# EAGLE design uNimbus_board_1_v1_2 (EAGLE 9.3.1)

## Sheet 1 of 2
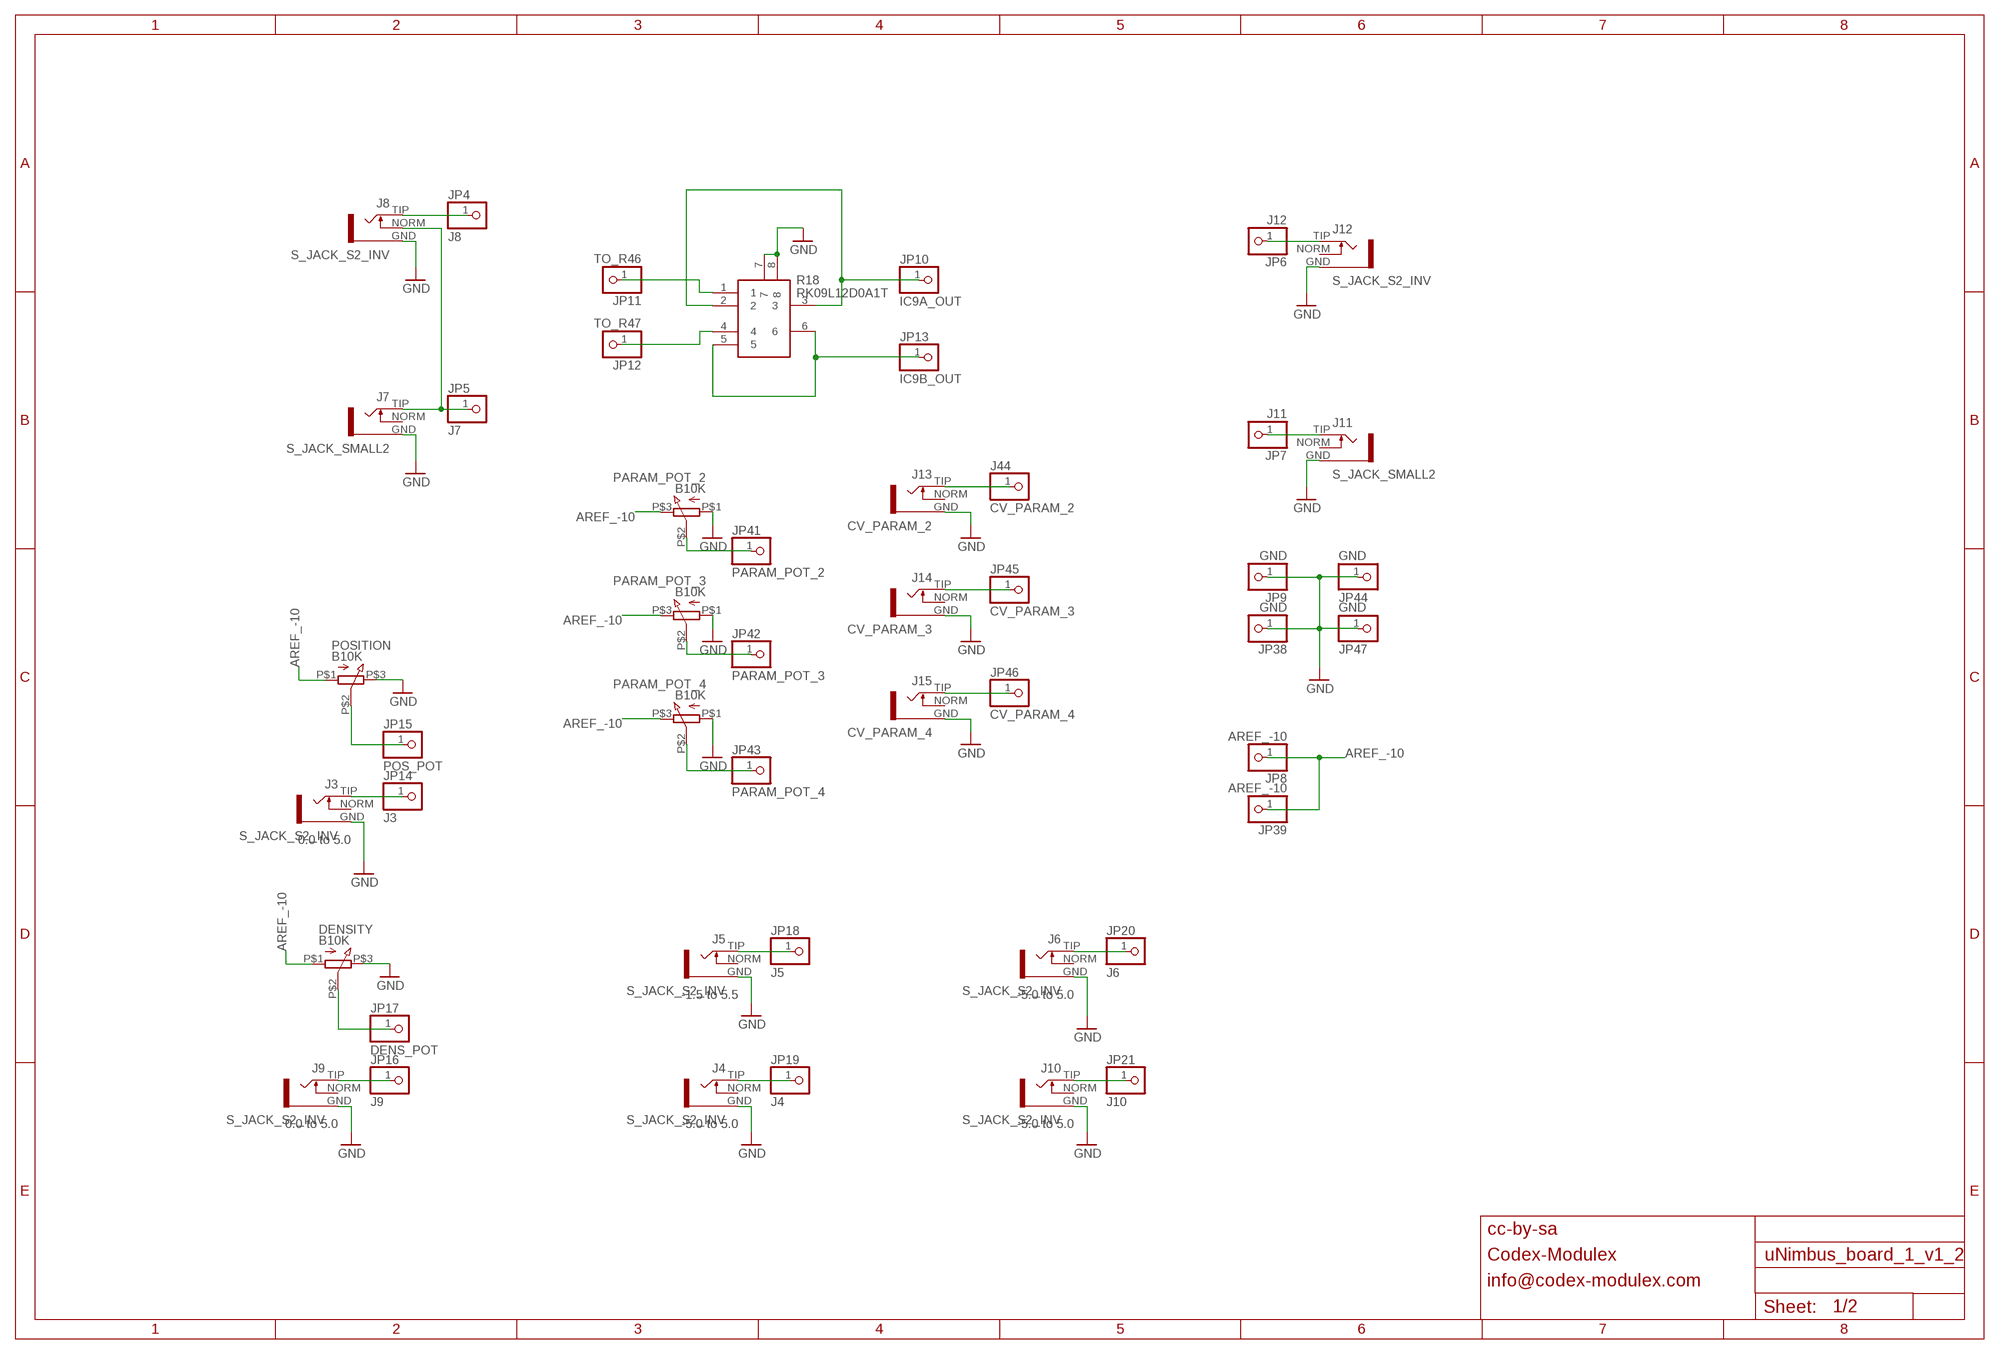
[diagram p0: schematic, sheet 1]

### Parts
DENSITY  B10K  Q-POT2  [Q-POT2]
J3  S_JACK_S2_INV  [S_JACK_S2_INV]
J4  S_JACK_S2_INV  [S_JACK_S2_INV]
J5  S_JACK_S2_INV  [S_JACK_S2_INV]
J6  S_JACK_S2_INV  [S_JACK_S2_INV]
J7  S_JACK_SMALL2  [S_JACK_SMALL2]
J8  S_JACK_S2_INV  [S_JACK_S2_INV]
J9  S_JACK_S2_INV  [S_JACK_S2_INV]
J10  S_JACK_S2_INV  [S_JACK_S2_INV]
J11  S_JACK_SMALL2  [S_JACK_SMALL2]
J12  S_JACK_S2_INV  [S_JACK_S2_INV]
J13  CV_PARAM_2  S_JACK_S2_INV  [S_JACK_S2_INV]
J14  CV_PARAM_3  S_JACK_S2_INV  [S_JACK_S2_INV]
J15  CV_PARAM_4  S_JACK_S2_INV  [S_JACK_S2_INV]
J44  CV_PARAM_2  PARTS_AMAN_PINHD-1X1  [PARTS_AMAN_1X01]
JP4  J8  PARTS_AMAN_PINHD-1X1  [PARTS_AMAN_1X01]
JP5  J7  PARTS_AMAN_PINHD-1X1  [PARTS_AMAN_1X01]
JP6  J12  PARTS_AMAN_PINHD-1X1  [PARTS_AMAN_1X01]
JP7  J11  PARTS_AMAN_PINHD-1X1  [PARTS_AMAN_1X01]
JP8  AREF_-10  PARTS_AMAN_PINHD-1X1  [PARTS_AMAN_1X01]
JP9  GND  PARTS_AMAN_PINHD-1X1  [PARTS_AMAN_1X01]
JP10  IC9A_OUT  PARTS_AMAN_PINHD-1X1  [PARTS_AMAN_1X01]
JP11  TO_R46  PARTS_AMAN_PINHD-1X1  [PARTS_AMAN_1X01]
JP12  TO_R47  PARTS_AMAN_PINHD-1X1  [PARTS_AMAN_1X01]
JP13  IC9B_OUT  PARTS_AMAN_PINHD-1X1  [PARTS_AMAN_1X01]
JP14  J3  PARTS_AMAN_PINHD-1X1  [PARTS_AMAN_1X01]
JP15  POS_POT  PARTS_AMAN_PINHD-1X1  [PARTS_AMAN_1X01]
JP16  J9  PARTS_AMAN_PINHD-1X1  [PARTS_AMAN_1X01]
JP17  DENS_POT  PARTS_AMAN_PINHD-1X1  [PARTS_AMAN_1X01]
JP18  J5  PARTS_AMAN_PINHD-1X1  [PARTS_AMAN_1X01]
JP19  J4  PARTS_AMAN_PINHD-1X1  [PARTS_AMAN_1X01]
JP20  J6  PARTS_AMAN_PINHD-1X1  [PARTS_AMAN_1X01]
JP21  J10  PARTS_AMAN_PINHD-1X1  [PARTS_AMAN_1X01]
JP38  GND  PARTS_AMAN_PINHD-1X1  [PARTS_AMAN_1X01]
JP39  AREF_-10  PARTS_AMAN_PINHD-1X1  [PARTS_AMAN_1X01]
JP41  PARAM_POT_2  PARTS_AMAN_PINHD-1X1  [PARTS_AMAN_1X01]
JP42  PARAM_POT_3  PARTS_AMAN_PINHD-1X1  [PARTS_AMAN_1X01]
JP43  PARAM_POT_4  PARTS_AMAN_PINHD-1X1  [PARTS_AMAN_1X01]
JP44  GND  PARTS_AMAN_PINHD-1X1  [PARTS_AMAN_1X01]
JP45  CV_PARAM_3  PARTS_AMAN_PINHD-1X1  [PARTS_AMAN_1X01]
JP46  CV_PARAM_4  PARTS_AMAN_PINHD-1X1  [PARTS_AMAN_1X01]
JP47  GND  PARTS_AMAN_PINHD-1X1  [PARTS_AMAN_1X01]
PARAM_POT_2  B10K  Q-POT2  [Q-POT2]
PARAM_POT_3  B10K  Q-POT2  [Q-POT2]
PARAM_POT_4  B10K  Q-POT2  [Q-POT2]
POSITION  B10K  Q-POT2  [Q-POT2]
R18  RK09L12D0A1T  [RK09L12D0A1T]

### Nets
AREF_-10: DENSITY.P$1 JP8.1 JP39.1 PARAM_POT_2.P$3 PARAM_POT_3.P$3 PARAM_POT_4.P$3 POSITION.P$1
GND: DENSITY.P$3 J3.GND J4.GND J5.GND J6.GND J7.GND J8.GND J9.GND J10.GND J11.GND J12.GND J13.GND J14.GND J15.GND JP9.1 JP38.1 JP44.1 JP47.1 PARAM_POT_2.P$1 PARAM_POT_3.P$1 PARAM_POT_4.P$1 POSITION.P$3 R18.7 R18.8 ; also sheet 2
LOUT_JACK: J11.TIP JP7.1
N$1: J4.TIP JP19.1
N$4: J10.TIP JP21.1
N$6: J6.TIP JP20.1
N$10: J5.TIP JP18.1
N$14: J9.TIP JP16.1
N$18: JP12.1 R18.4
N$20: J8.TIP JP4.1
N$21: J7.TIP J8.NORM JP5.1
N$22: JP13.1 R18.5 R18.6
N$25: JP42.1 PARAM_POT_3.P$2
N$26: DENSITY.P$2 JP17.1
N$27: J3.TIP JP14.1
N$28: JP43.1 PARAM_POT_4.P$2
N$30: JP41.1 PARAM_POT_2.P$2
N$31: JP11.1 R18.1
N$32: J15.TIP JP46.1
N$33: J14.TIP JP45.1
N$35: JP15.1 POSITION.P$2
N$37: J13.TIP J44.1
N$42: JP10.1 R18.2 R18.3
ROUT_JACK: J12.TIP JP6.1
Unconnected: J3.NORM J4.NORM J5.NORM J6.NORM J7.NORM J9.NORM J10.NORM J11.NORM J12.NORM J13.NORM J14.NORM J15.NORM

### Notes on the sheet
- 0.0 to 5.0
- -1.5 to 5.5 | -5.0 to 5.0
- 0.0 to 5.0 | -5.0 to 5.0 | -5.0 to 5.0
- cc-by-sa
- Codex-Modulex
- info@codex-modulex.com

## Sheet 2 of 2
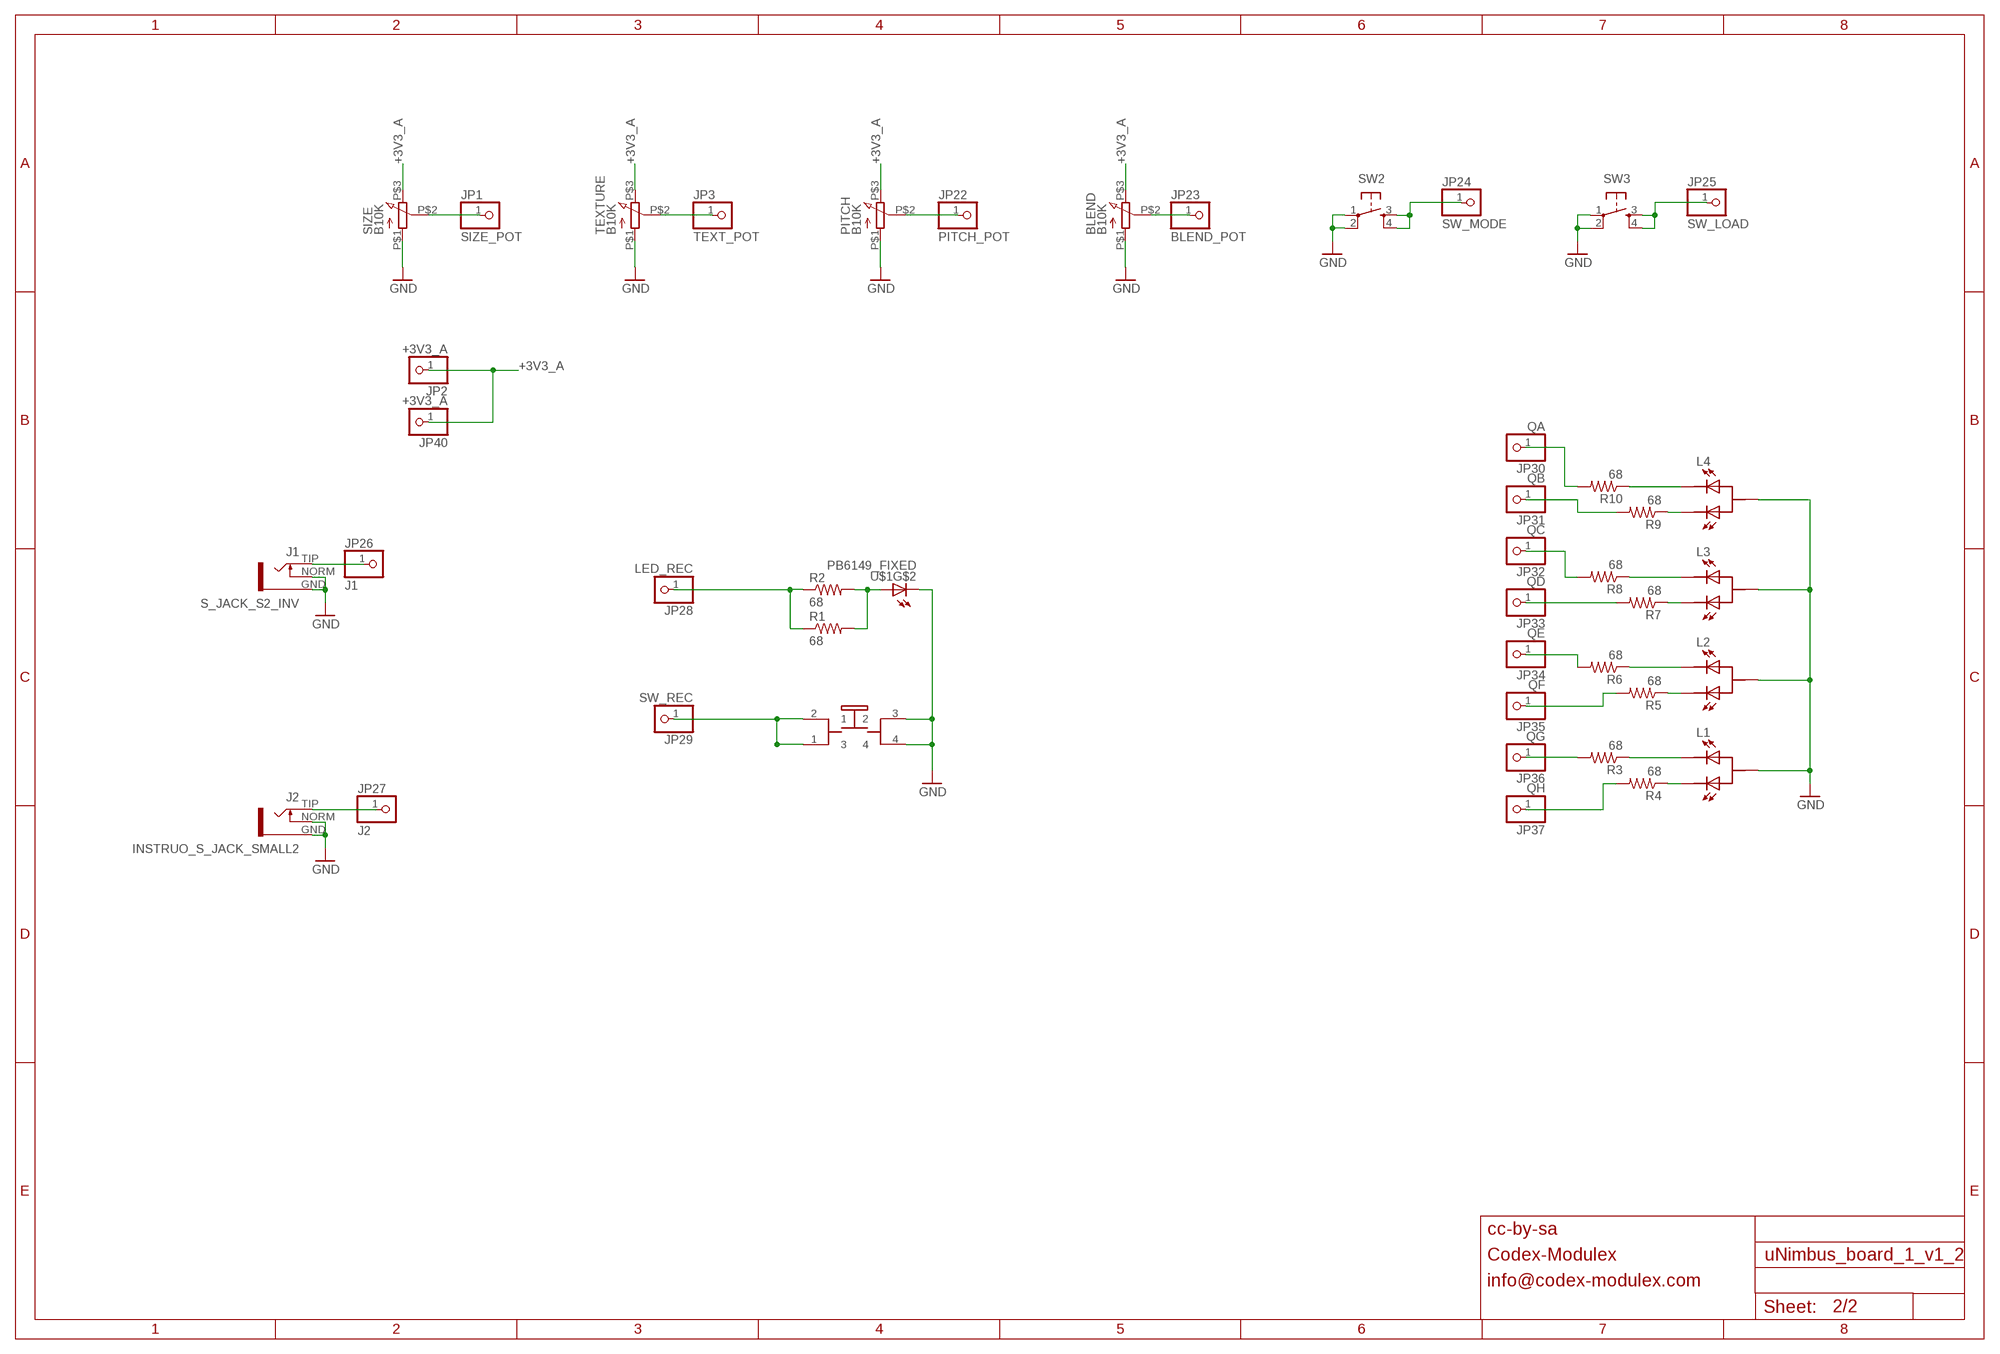
[diagram p1: schematic, sheet 2]

### Parts
BLEND  B10K  Q-POT2  [Q-POT2]
J1  S_JACK_S2_INV  [S_JACK_S2_INV]
J2  INSTRUO_S_JACK_SMALL2  [INSTRUO_S_JACK_SMALL2]
JP1  SIZE_POT  PARTS_AMAN_PINHD-1X1  [PARTS_AMAN_1X01]
JP2  +3V3_A  PARTS_AMAN_PINHD-1X1  [PARTS_AMAN_1X01]
JP3  TEXT_POT  PARTS_AMAN_PINHD-1X1  [PARTS_AMAN_1X01]
JP22  PITCH_POT  PARTS_AMAN_PINHD-1X1  [PARTS_AMAN_1X01]
JP23  BLEND_POT  PARTS_AMAN_PINHD-1X1  [PARTS_AMAN_1X01]
JP24  SW_MODE  PARTS_AMAN_PINHD-1X1  [PARTS_AMAN_1X01]
JP25  SW_LOAD  PARTS_AMAN_PINHD-1X1  [PARTS_AMAN_1X01]
JP26  J1  PARTS_AMAN_PINHD-1X1  [PARTS_AMAN_1X01]
JP27  J2  PARTS_AMAN_PINHD-1X1  [PARTS_AMAN_1X01]
JP28  LED_REC  PARTS_AMAN_PINHD-1X1  [PARTS_AMAN_1X01]
JP29  SW_REC  PARTS_AMAN_PINHD-1X1  [PARTS_AMAN_1X01]
JP30  QA  PARTS_AMAN_PINHD-1X1  [PARTS_AMAN_1X01]
JP31  QB  PARTS_AMAN_PINHD-1X1  [PARTS_AMAN_1X01]
JP32  QC  PARTS_AMAN_PINHD-1X1  [PARTS_AMAN_1X01]
JP33  QD  PARTS_AMAN_PINHD-1X1  [PARTS_AMAN_1X01]
JP34  QE  PARTS_AMAN_PINHD-1X1  [PARTS_AMAN_1X01]
JP35  QF  PARTS_AMAN_PINHD-1X1  [PARTS_AMAN_1X01]
JP36  QG  PARTS_AMAN_PINHD-1X1  [PARTS_AMAN_1X01]
JP37  QH  PARTS_AMAN_PINHD-1X1  [PARTS_AMAN_1X01]
JP40  +3V3_A  PARTS_AMAN_PINHD-1X1  [PARTS_AMAN_1X01]
L1  LED_3MM_3PIN  [LED_3MM_3PIN]
L2  LED_3MM_3PIN  [LED_3MM_3PIN]
L3  LED_3MM_3PIN  [LED_3MM_3PIN]
L4  LED_3MM_3PIN  [LED_3MM_3PIN]
PITCH  B10K  Q-POT2  [Q-POT2]
R1  68  R-US_R0603  [R0603]
R2  68  R-US_R0603  [R0603]
R3  68  R-US_R0603  [R0603]
R4  68  R-US_R0603  [R0603]
R5  68  R-US_R0603  [R0603]
R6  68  R-US_R0603  [R0603]
R7  68  R-US_R0603  [R0603]
R8  68  R-US_R0603  [R0603]
R9  68  R-US_R0603  [R0603]
R10  68  R-US_R0603  [R0603]
SIZE  B10K  Q-POT2  [Q-POT2]
SW2  TAC_SWITCHPTH  [TACTILE-PTH]
SW3  TAC_SWITCHPTH  [TACTILE-PTH]
TEXTURE  B10K  Q-POT2  [Q-POT2]
U$1  PB6149_FIXED  [PB6149L]

### Nets
+3V3_A: BLEND.P$3 JP2.1 JP40.1 PITCH.P$3 SIZE.P$3 TEXTURE.P$3
GND: BLEND.P$1 J1.GND J1.NORM J2.GND J2.NORM L1.A L2.A L3.A L4.A PITCH.P$1 SIZE.P$1 SW2.1 SW2.2 SW3.1 SW3.2 TEXTURE.P$1 U$1.3 U$1.4 U$1.K(C) ; also sheet 1
LED_REC: JP28.1 R1.1 R2.1
N$2: JP1.1 SIZE.P$2
N$3: JP3.1 TEXTURE.P$2
N$5: JP22.1 PITCH.P$2
N$7: BLEND.P$2 JP23.1
N$8: JP30.1 R10.2
N$9: L4.C1 R9.1
N$11: JP31.1 R9.2
N$12: L4.C2 R10.1
N$13: JP33.1 R7.2
N$15: JP34.1 R6.2
N$16: L3.C2 R8.1
N$17: JP35.1 R5.2
N$19: JP36.1 R3.2
N$23: JP37.1 R4.2
N$24: JP32.1 R8.2
N$29: L3.C1 R7.1
N$34: L2.C2 R6.1
N$36: J2.TIP JP27.1
N$38: R1.2 R2.2 U$1.A
N$39: L2.C1 R5.1
N$40: L1.C2 R3.1
N$41: L1.C1 R4.1
N$57: J1.TIP JP26.1
SW_LOAD: JP25.1 SW3.3 SW3.4
SW_MODE: JP24.1 SW2.3 SW2.4
SW_REC: JP29.1 U$1.1 U$1.2

### Notes on the sheet
- cc-by-sa
- Codex-Modulex
- info@codex-modulex.com

## Library data of the parts
BLEND DENSITY PITCH POSITION SIZE TEXTURE = INSTRUO:Q-POT2
J1 J4-J6 J8-J10 J12-J15 = INSTRUO:S_JACK_S2_INV
J2 = uClouds_002_:INSTRUO_S_JACK_SMALL2
J3 = uClouds_002:S_JACK_S2_INV
J7 = INSTRUO:S_JACK_SMALL2
J11 = uClouds_002:S_JACK_SMALL2
J44 JP1-JP47 = atom_v1_1_board_2:PARTS_AMAN_PINHD-1X1: PIN HEADER
L1-L4 = INSTRUO:LED_3MM_3PIN
PARAM_POT_2-PARAM_POT_4 = uClouds_002:Q-POT2
R1-R10 = rcl:R-US_: RESISTOR, American symbol
R18 = RK09L12D0A1T:RK09L12D0A1T: Alps Potentiometer RK09L Series with a 6 mm Dia. Shaft 10k 20% 0.05W, Logarithmic, Panel Mount (Through Hole) Source: Datasheet <https://componentsearchengine.com/Datasheets/1/RK09L12D0A1T.pdf>; DESCRIPTION: Alps Potentiometer RK09L Series with a 6 mm Dia. Shaft 10k 20% 0.05W, Logarithmic, Panel Mount (Through Hole); HEIGHT: mm; MANUFACTURER_NAME: ALPS; MANUFACTURER_PART_NUMBER: RK09L12D0A1T; MOUSER_PART_NUMBER: 688-RK09L12D0A1T
SW2 SW3 = SparkFun:TAC_SWITCH: Momentary Switch Button commonly used for reset or general input. Spark Fun Electronics SKU : COM-00097
U$1 = INSTRUO:PB6149_FIXED

## Board
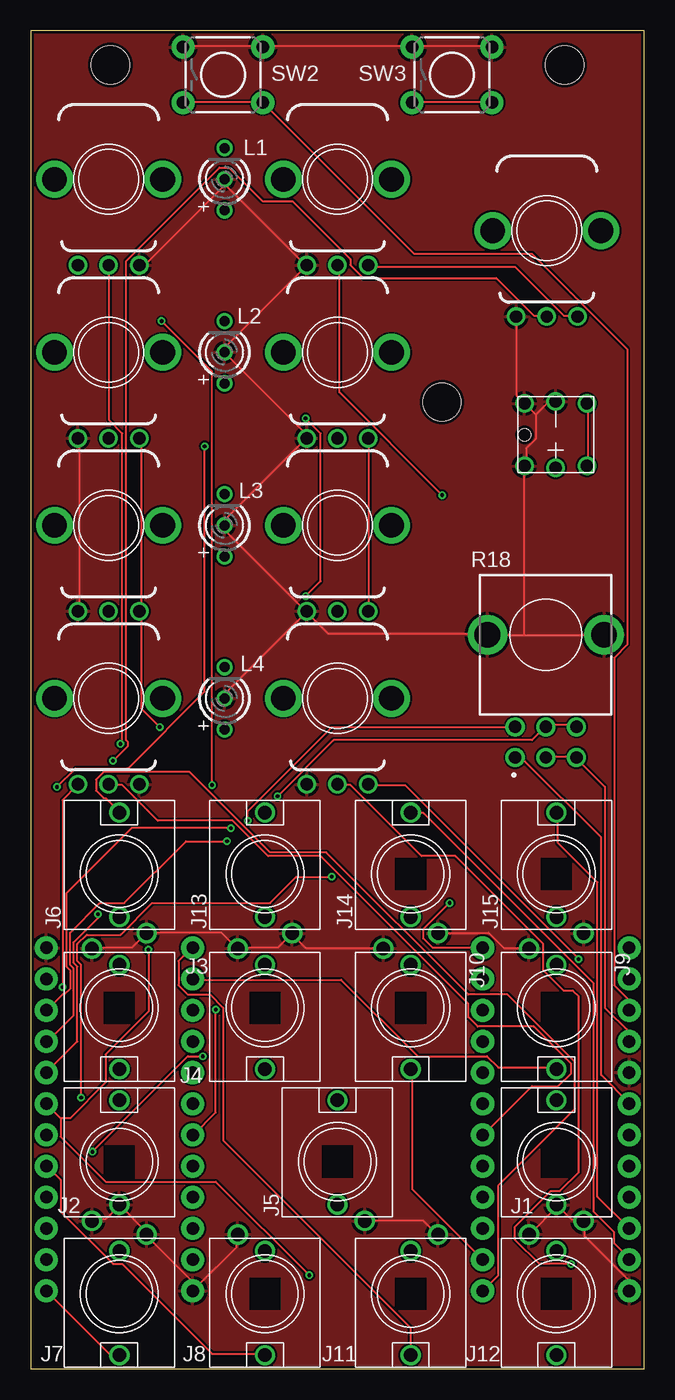
[diagram p2: board, top side]
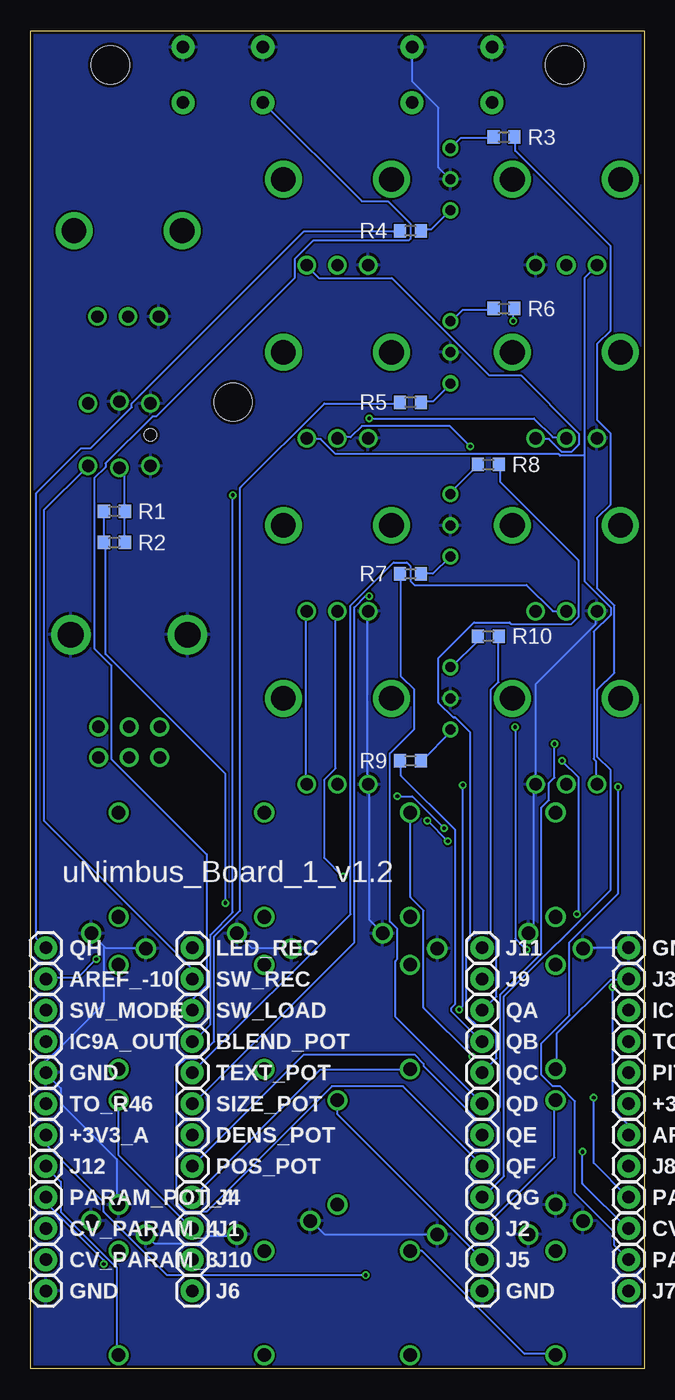
[diagram p3: board, bottom side, seen from below]

Size 50 x 109 mm. Coordinates in mm from the lower left corner, seen from the top.
Outline: 0,0 50,0 50,109 0,109 0,0
Copper layers (1*16): Top 0.035mm / dielectric 1.5mm / Bottom 0.035mm
Design rules "dirt_cheap_dirty_boards.v1.1": minimum track width 6mil, minimum drill 12mil, track to track 6mil, track to pad 6mil, pad to pad 6mil, via to via 6mil, smd to smd 0mil, copper to edge 10mil, drill to drill 10mil, minimum pad ring 10mil, minimum via ring 6mil, stop-mask expansion 2mil, vias tented up to drill 25mil, thermal gap 10mil
Holes 3.1 mm at 6.5,106.2 43.5,106.2 33.51,78.74

### Footprints (pad centres in the part's own frame; a part is rotated, then mirrored left to right if it is on the bottom)
Q-POT2 = drill 1 pad 1.5: P$1 -2.5,-7; P$2 0,-7; P$3 2.5,-7 | drill 2 pad 2.5: P$4 -4.4,0; P$5 4.4,0
S_JACK_S2_INV = drill 1.1: GND 2.223,-4.826; NORM 0,-3.5; TIP 0,5
INSTRUO_S_JACK_SMALL2 = drill 1.1: GND -2.223,-4.826; NORM 0,-3.5; TIP 0,5
S_JACK_SMALL2 = drill 1.1: GND -2.223,-4.826; NORM 0,-3.5; TIP 0,5
PARTS_AMAN_1X01 = drill 1.016 pad 1.88: 1 0,0
LED_3MM_3PIN = drill 0.813: A 0,0; C1 -2.54,0; C2 2.54,0
R0603 = smd 1 x 1.1: 1 -0.85,0; 2 0.85,0
RK09L12D0A1T = drill 1 pad 1.55: 1 -2.5,-14.85; 2 0,-14.85; 3 2.5,-14.85; 4 -2.5,-12.35; 5 0,-12.35; 6 2.5,-12.35 | drill 2.11 pad 3.2: 7 -4.75,-4.85; 8 4.75,-4.85
TACTILE-PTH = drill 1.016 pad 1.88: 1 -3.251,2.261; 2 3.251,2.261; 3 -3.251,-2.261; 4 3.251,-2.261
PB6149L = drill 1: 1 2.54,-2.54; 2 2.54,2.54; 3 -2.54,-2.54; 4 -2.54,2.54; A 0,-2.7; K 0,2.7 | hole 1: -2.54,0

### Placement (x,y rotation side)
BLEND  25,96.9 0 top
DENSITY  6.35,54.61 0 top
J1  42.84,16.87 0 top
J2  7.22,16.87 0 top
J3  7.22,29.41 180 top
J4  19.09,29.41 180 top
J5  25,16.87 0 top
J6  7.22,40.31 0 top
J7  7.22,6.11 180 top
J8  19.09,6.11 180 top
J9  42.84,29.41 180 top
J10  30.97,29.41 180 top
J11  30.97,6.11 180 top
J12  42.84,6.11 180 top
J13  19.09,40.31 0 top
J14  30.97,40.31 0 top
J15  42.84,40.31 0 top
J44  1.27,11.43 0 bottom
JP1  36.83,21.59 0 bottom
JP2  48.77,19.05 0 bottom
JP3  36.83,24.13 0 bottom
JP4  1.27,16.51 0 bottom
JP5  1.27,6.35 0 bottom
JP6  48.77,16.51 0 bottom
JP7  13.21,34.29 0 bottom
JP8  1.27,19.05 0 bottom
JP9  1.27,34.29 0 bottom
JP10  48.77,26.67 0 bottom
JP11  48.77,21.59 0 bottom
JP12  1.27,26.67 0 bottom
JP13  1.27,29.21 0 bottom
JP14  1.27,31.75 0 bottom
JP15  36.83,16.51 0 bottom
JP16  13.21,31.75 0 bottom
JP17  36.83,19.05 0 bottom
JP18  13.21,8.89 0 bottom
JP19  36.83,13.97 0 bottom
JP20  36.83,6.35 0 bottom
JP21  36.83,8.89 0 bottom
JP22  1.27,24.13 0 bottom
JP23  36.83,26.67 0 bottom
JP24  48.77,29.21 0 bottom
JP25  36.83,29.21 0 bottom
JP26  36.83,11.43 0 bottom
JP27  13.21,11.43 0 bottom
JP28  36.83,34.29 0 bottom
JP29  36.83,31.75 0 bottom
JP30  13.21,29.21 0 bottom
JP31  13.21,26.67 0 bottom
JP32  13.21,24.13 0 bottom
JP33  13.21,21.59 0 bottom
JP34  13.21,19.05 0 bottom
JP35  13.21,16.51 0 bottom
JP36  13.21,13.97 0 bottom
JP37  48.77,34.29 0 bottom
JP38  13.21,6.35 0 bottom
JP39  48.77,31.75 0 bottom
JP40  1.27,21.59 0 bottom
JP41  1.27,8.89 0 bottom
JP42  1.27,13.97 0 bottom
JP43  48.77,13.97 0 bottom
JP44  48.77,24.13 0 bottom
JP45  48.77,8.89 0 bottom
JP46  48.77,11.43 0 bottom
JP47  48.77,6.35 0 bottom
L1  15.8,96.9 90 top
L2  15.8,82.8 90 top
L3  15.8,68.71 90 top
L4  15.8,54.61 90 top
PARAM_POT_2  25,82.8 0 top
PARAM_POT_3  25,68.71 0 top
PARAM_POT_4  25,54.61 0 top
PITCH  42.06,92.71 0 top
POSITION  6.35,96.9 0 top
R1  43.18,69.85 0 bottom
R2  43.18,67.31 0 bottom
R3  11.43,100.33 0 bottom
R4  19.05,92.71 180 bottom
R5  19.05,78.74 180 bottom
R6  11.43,86.36 0 bottom
R7  19.05,64.77 180 bottom
R8  12.7,73.66 0 bottom
R9  19.05,49.53 180 bottom
R10  12.7,59.69 0 bottom
R18  41.98,64.64 0 top
SIZE  6.35,82.8 0 top
SW2  15.67,105.41 0 top
SW3  34.33,105.41 0 top
TEXTURE  6.35,68.71 0 top
U$1  42.78,76.09 0 top

### Tracks (layer width: path | path; a pad name or v marks a point on that pad's centre or on a via)
+3V3_A  (via drill 0.3)
  Top 0.152: v22.71,7.62 15.09,15.24 6.1,15.24 2.44,18.9 2.44,20.42 | JP40.1 2.44,20.42 | SIZE.P$3 8.99,75.74 8.99,61.72 TEXTURE.P$3 8.99,61.57 8.99,53.8 v10.52,52.27 | PITCH.P$3 44.5,85.8 43.43,85.8 39.47,89.76 27.58,89.76 BLEND.P$3 | 2.44,20.42 3.2,20.42 6.1,23.32 6.1,25.6 9.6,29.11 v9.6,34.14
  Bottom 0.152: JP2.1 48.77,18.29 44.04,13.56 44.04,12.8 38.86,7.62 v22.71,7.62 | SIZE.P$3 8.84,75.74 7.77,75.74 6.71,74.68 5.94,74.68 5.33,75.29 5.33,76.2 10.06,80.92 12.65,80.92 20.57,88.85 26.52,88.85 27.43,89.76 BLEND.P$3 | v9.6,34.14 10.52,35.05 v10.52,52.27
AREF_-10  (via drill 0.3)
  Top 0.152: PARAM_POT_2.P$3 27.58,75.74 27.58,61.72 PARAM_POT_3.P$3 | v44.65,33.38 30.48,47.55 27.58,47.55 PARAM_POT_4.P$3 | v2.59,31.09 2.59,46.33 3.81,47.55 DENSITY.P$1
  Bottom 0.152: PARAM_POT_4.P$3 27.58,47.7 27.58,61.57 PARAM_POT_3.P$3 | v44.65,33.38 46.18,31.85 48.77,31.85 JP39.1 | 4.88,74.37 4.88,88.85 3.96,89.76 POSITION.P$1 | 4.88,74.37 4.88,64.16 2.74,62.03 2.74,61.42 4.12,60.05 4.12,49.68 3.96,49.53 3.96,47.7 DENSITY.P$1 | v2.59,31.09 2.59,21.18 1.37,19.96 1.37,19.05 JP8.1 | 4.88,74.37 6.86,74.37 7.01,74.52 25.15,74.52 26.36,75.74 27.43,75.74 PARAM_POT_2.P$3
GND
  Top 0.152: 41.15,77.72 41.15,75.74 40.39,74.98 40.39,73.61 U$1.3 40.23,73.46 40.23,59.74 | 41.15,77.72 40.39,78.49 U$1.4 39.62,79.25 39.62,85.65 PITCH.P$1 | 41.15,77.72 42.22,78.79 42.67,78.79 U$1.K | 40.23,59.74 46.63,59.74 R18.8 | 40.23,59.74 37.34,59.74 R18.7 37.19,59.89 24.23,59.89 22.55,61.57 PARAM_POT_3.P$1 | SW2.1 12.5,107.75 18.9,107.75 SW2.2 19.05,107.75 30.94,107.75 SW3.1 31.09,107.75 37.49,107.75 SW3.2 | L4.A 15.85,54.71 15.85,55.02 22.4,61.57 PARAM_POT_3.P$1 | PARAM_POT_3.P$1 22.4,61.72 15.85,68.28 15.85,68.58 L3.A 15.85,68.73 15.85,69.19 22.4,75.74 PARAM_POT_2.P$1 22.4,75.89 22.4,76.2 15.85,82.75 L2.A 15.85,82.91 15.85,83.21 22.4,89.76 BLEND.P$1 22.4,89.92 15.85,96.47 | 15.85,96.47 15.85,96.77 L1.A 15.85,96.47 | 15.85,96.47 9.3,89.92 8.99,89.92 POSITION.P$3 | J2.GND 5.03,12.19 6.1,12.19 7.16,13.26 J2.NORM 7.32,13.26 9.3,11.28 9.3,10.97 J7.GND 9.45,10.82 13.56,6.71 | 13.56,6.71 JP38.1 13.26,6.4 | 13.56,6.71 16.76,9.91 16.76,10.82 J8.GND | J5.GND 27.28,12.04 32,12.04 33.07,10.97 J11.GND | 42.98,13.26 40.69,10.97 J12.GND | 42.98,13.26 44.04,12.19 44.96,12.19 J1.GND 45.11,12.04 45.11,10.82 48.77,7.16 JP47.1 | 42.98,13.26 J1.NORM | TEXTURE.P$1 3.96,61.72 3.96,75.74 SIZE.P$1 | J3.GND 5.03,34.29 8.23,34.29 9.3,35.36 J6.GND 9.45,35.51 15.54,35.51 16.76,34.29 J4.GND 16.92,34.29 20.12,34.29 21.18,35.36 J13.GND 21.34,35.36 22.4,34.29 28.65,34.29 J10.GND | J9.GND 40.54,34.29 38.56,34.29 37.34,35.51 33.22,35.51 J14.GND
  Bottom 0.152: SW2.2 18.9,107.59 18.9,104.85 16.76,102.72 16.76,97.84 15.85,96.93 L1.A | J11.GND 33.22,10.82 35.66,10.82 36.27,10.21 39.93,10.21 40.54,10.82 J12.GND | J8.GND 16.92,10.97 26.06,10.97 27.13,12.04 J5.GND | JP9.1 4.88,34.29 J3.GND | J6.GND 9.3,35.51 8.99,35.81 8.99,47.55 DENSITY.P$3 8.84,47.7 8.84,55.78 3.96,60.66 3.96,61.57 TEXTURE.P$1 | 44.04,34.44 44.96,35.36 J15.GND | 44.04,34.44 43.89,34.29 40.69,34.29 J9.GND | 44.04,34.44 44.04,29.72 48.77,24.99 JP44.1 48.77,24.08 47.55,22.86 47.55,21.64 42.98,17.07 42.98,13.41 J1.NORM | J10.GND 28.8,34.29 32,34.29 33.07,35.36 J14.GND | J13.GND 21.34,35.51 22.4,36.58 22.4,47.55 PARAM_POT_4.P$1 22.55,47.7 22.55,61.57 PARAM_POT_3.P$1
  pour Top (isolate 0.012): 0,108.97 50.04,108.97 50.04,0 0,0
  pour Bottom (isolate 0.012): 0,108.97 50.04,108.97 50.04,0 0,0
LED_REC  (via drill 0.3)
  Top 0.152: v34.14,37.95 32,35.81 32,35.05 32.77,34.29 JP28.1
  Bottom 0.152: R1.1 44.04,69.8 44.04,67.36 R2.1 43.89,67.21 43.89,58.22 34.14,48.46 v34.14,37.95
LOUT_JACK
  Top 0.152: J11.TIP 30.94,1.22 30.94,3.35 15.7,18.59 15.7,29.41 14.63,30.48 12.8,30.48 12.04,31.24 12.04,33.22 13.11,34.29 JP7.1
N$1
  Bottom 0.152: J4.TIP 19.2,24.38 26.36,24.38 36.73,14.02 JP19.1
N$2  (via drill 0.3)
  Top 0.152: v22.4,77.42 23.62,76.2 23.62,64.16 v22.4,62.94
  Bottom 0.152: v22.4,77.42 8.99,77.42 7.47,75.89 6.4,75.89 SIZE.P$2 | v22.4,62.94 22.71,62.94 23.62,62.03 23.62,34.75 36.73,21.64 JP1.1
N$3
  Bottom 0.152: JP3.1 23.93,37.03 23.93,62.18 20.42,65.68 19.36,65.68 19.05,65.38 19.05,64.16 18.75,63.86 9.6,63.86 7.47,61.72 6.4,61.72 TEXTURE.P$2
N$4
  Top 0.152: JP21.1 31.09,14.63 31.09,24.38 J10.TIP
N$5  (via drill 0.3)
  Top 0.152: v6.71,49.53 7.92,50.75 7.92,51.05 7.77,51.21 7.77,90.22 15.39,97.84 16.15,97.84 18.9,95.1 21.34,95.1 26.06,90.37 26.06,89.92 27.13,88.85 37.95,88.85 41,85.8 41.91,85.8 PITCH.P$2 | v5.49,37.03 5.49,36.73 3.5,34.75 3.5,33.07 3.81,32.77 3.81,26.67 JP22.1
  Bottom 0.152: v6.71,49.53 5.33,48.16 5.33,37.19 v5.49,37.03
N$6
  Top 0.152: JP20.1 38.1,7.62 38.1,14.94 44.35,21.18 44.35,24.99 38.86,30.48 35.66,30.48 24.08,42.06 19.51,42.06 12.95,48.62 5.94,48.62 5.33,48.01 5.33,47.09 5.94,46.48 6.1,46.48 7.16,45.41 J6.TIP
N$7  (via drill 0.3)
  Top 0.152: v33.53,71.17 25.15,79.55 25.15,89.76 BLEND.P$2
  Bottom 0.152: v33.53,71.17 33.53,37.19 35.36,35.36 35.36,28.04 36.73,26.67 JP23.1
N$8
  Bottom 0.152: R10.2 11.89,59.59 11.89,55.93 12.5,55.32 12.5,35.36 12.04,34.9 12.04,30.33 13.11,29.26 JP30.1
N$9
  Bottom 0.152: R9.1 18.14,49.53 15.7,51.97 L4.C1
N$10
  Bottom 0.152: J5.TIP 24.99,21.79 24.99,20.73 13.26,8.99 JP18.1
N$11
  Bottom 0.152: R9.2 19.81,49.53 19.81,48.31 15.39,43.89 15.39,29.72 15.7,29.41 15.7,29.11 13.26,26.67 JP31.1
N$12
  Bottom 0.152: R10.1 13.56,59.59 13.56,59.28 15.7,57.15 L4.C2
N$13
  Bottom 0.152: JP33.1 20.27,28.65 20.27,33.22 20.12,33.38 20.12,35.81 20.73,36.42 20.73,50.14 18.75,52.12 18.75,55.32 19.81,56.39 19.81,64.77 R7.2
N$14
  Top 0.152: J9.TIP 42.82,24.54 38.1,24.54 37.19,25.45 31.55,25.45 25.3,31.7 13.26,31.7 JP16.1
N$15  (via drill 0.3)
  Top 0.152: v10.67,85.34 14.78,81.23 v14.78,47.55 | v15.09,29.26 15.09,20.88 13.26,19.05 JP34.1
  Bottom 0.152: v10.67,85.34 10.67,86.26 R6.2 | v14.78,47.55 14.78,29.57 v15.09,29.26
N$16
  Bottom 0.152: R8.1 13.56,73.61 15.85,71.32 L3.C2
N$17
  Bottom 0.152: R5.2 19.96,78.64 26.06,78.64 32.92,71.78 32.92,37.34 35.05,35.2 35.05,26.67 36.42,25.3 37.34,25.3 38.1,24.54 38.1,13.56 37.34,12.8 35.66,12.8 25.45,23.01 19.66,23.01 13.26,16.61 JP35.1
N$18  (via drill 0.3)
  Top 0.152: v17.68,44.65 17.68,45.41 24.54,52.27 39.47,52.27 R18.4 | v16,42.98 12.65,42.98 7.62,37.95 5.64,37.95 3.2,35.51 3.2,32.92 3.5,32.61 3.5,28.8 1.37,26.67 JP12.1
  Bottom 0.152: v16,42.98 v17.68,44.65
N$19
  Bottom 0.152: R3.2 10.52,100.28 10.52,99.21 2.74,91.44 2.74,84.58 3.81,83.52 3.81,77.27 2.74,76.2 2.74,70.41 3.81,69.34 3.81,63.55 2.44,62.18 2.44,56.69 3.81,55.32 3.81,49.84 2.74,48.77 2.74,39.01 11.43,30.33 11.43,15.7 13.11,14.02 JP36.1
N$20
  Top 0.152: J8.TIP 19.05,1.22 14.78,1.22 7.47,8.53 6.71,8.53 2.44,12.8 2.44,15.39 1.37,16.46 JP4.1
N$21
  Top 0.152: JP5.1 6.4,1.22 7.16,1.22 J7.TIP
  Bottom 0.152: J8.NORM 19.05,9.6 18.14,9.6 9.75,1.22 7.32,1.22 J7.TIP
N$22  (via drill 0.3)
  Top 0.152: R18.6 44.35,52.43 42.06,52.43 R18.5 41.91,52.27 40.84,51.21 24.69,51.21 v20.12,46.63 | v16.31,44.04 8.23,44.04 2.9,38.71 2.9,32.77 3.2,32.46 3.2,30.94 2.74,30.48 2.59,30.48 1.37,29.26 JP13.1
  Bottom 0.152: v16.31,44.04 18.9,46.63 v20.12,46.63
N$23
  Bottom 0.152: JP37.1 49.53,35.05 49.53,71.32 45.87,74.98 45.11,74.98 41.76,78.33 41.76,78.64 27.74,92.66 19.96,92.66 R4.2
N$24
  Bottom 0.152: JP32.1 12.04,25.3 12.04,27.28 12.65,27.89 13.56,27.89 14.48,28.8 14.48,34.75 14.17,35.05 14.17,51.82 15.39,53.03 15.54,53.03 16.76,54.25 16.76,57.91 13.87,60.81 10.97,60.81 10.82,60.66 5.94,60.66 5.33,61.27 5.33,65.84 11.73,72.24 11.73,73.61 R8.2
N$25  (via drill 0.3)
  Top 0.152: v24.54,40.08 21.64,40.08 19.51,37.95 9.91,37.95 7.32,35.36 4.57,35.36 3.81,34.59 3.81,33.22 4.12,32.92 v4.12,22.1
  Bottom 0.152: v24.54,40.08 26.06,41.6 26.06,48.01 25.15,48.92 25.15,61.57 PARAM_POT_3.P$2 | v4.12,22.1 4.12,16.76 1.37,14.02 JP42.1
N$26
  Top 0.152: DENSITY.P$2 6.4,47.55 7.47,47.55 10.36,44.65 16.46,44.65 19.36,41.76 23.62,41.76 35.66,29.72 35.66,28.65 36.42,27.89 41,27.89 44.04,24.84 44.04,24.08 42.98,23.01 40.84,23.01 36.88,19.05 JP17.1
N$27
  Bottom 0.152: J3.TIP 7.16,24.54 7.16,27.28 2.74,31.7 1.37,31.7 JP14.1
N$28  (via drill 0.3)
  Top 0.152: v44.04,8.53 41.45,8.53 39.47,10.52 39.47,11.58 42.37,14.48 43.13,14.48 44.65,16 44.65,30.33 44.2,30.79 43.43,30.79 41.76,32.46 41.76,34.59 34.59,41.76 31.85,41.76 26.06,47.55 25.15,47.55 PARAM_POT_4.P$2
  Bottom 0.152: v44.04,8.53 44.04,8.84 48.77,13.56 JP43.1
N$29
  Bottom 0.152: R7.1 17.22,64.77 15.85,66.14 L3.C1
N$30  (via drill 0.3)
  Top 0.152: v14.17,75.13 14.17,55.17 7.92,48.92 3.66,48.92 v2.13,47.4
  Bottom 0.152: v14.17,75.13 15.85,76.81 23.01,76.81 23.93,75.89 24.99,75.89 PARAM_POT_2.P$2 | v2.13,47.4 2.13,38.71 6.1,34.75 6.1,28.8 8.38,26.52 8.38,23.93 7.47,23.01 6.86,23.01 5.64,21.79 5.64,14.33 2.44,11.12 2.44,10.06 JP41.1
N$31
  Top 0.152: R18.1 39.62,49.68 40.08,49.68 46.48,43.28 46.48,23.93 48.77,21.64 JP11.1
N$32
  Top 0.152: JP46.1 46.18,14.02 46.18,39.62 42.98,42.82 42.98,45.26 J15.TIP
N$33
  Top 0.152: J14.TIP 31.09,45.26 32,45.26 45.87,31.39 45.87,12.8 47.55,11.12 47.55,10.21 48.77,8.99 JP45.1
N$34
  Bottom 0.152: R6.1 12.34,86.26 14.78,86.26 15.7,85.34 L2.C2
N$35  (via drill 0.3)
  Top 0.152: v7.32,50.9 7.47,51.05 7.47,76.2 6.4,77.27 6.4,89.76 POSITION.P$2
  Bottom 0.152: v7.32,50.9 7.32,48.16 7.77,47.7 7.77,46.33 8.38,45.72 8.38,33.83 11.73,30.48 11.73,21.34 12.65,20.42 13.72,20.42 17.98,24.69 17.98,24.84 18.75,25.6 27.74,25.6 JP15.1
N$36
  Bottom 0.152: J2.TIP 7.32,21.79 7.32,17.22 13.11,11.43 JP27.1
N$37  (via drill 0.3)
  Top 0.152: v14.02,25.45 12.8,25.45 v5.03,17.68
  Bottom 0.152: v14.02,25.45 17.98,29.41 17.98,37.34 19.05,38.41 19.05,45.26 J13.TIP | v5.03,17.68 5.03,15.09 1.37,11.43 J44.1
N$38
  Bottom 0.152: R2.2 42.37,67.36 42.37,69.8 R1.2 42.37,69.95 42.37,73 42.67,73.3 U$1.A
N$39
  Bottom 0.152: R5.1 18.14,78.79 17.22,78.79 15.85,80.16 L2.C1
N$40
  Bottom 0.152: R3.1 12.34,100.28 14.94,100.28 15.7,99.52 L1.C2
N$41
  Bottom 0.152: R4.1 18.14,92.81 17.37,92.81 15.85,94.34 L1.C1
N$42
  Top 0.152: R18.2 42.06,49.84 44.35,49.84 R18.3 44.5,49.68 46.79,47.4 46.79,29.41 48.77,27.43 JP10.1
N$57
  Bottom 0.152: J1.TIP 42.82,21.79 42.82,17.37 36.88,11.43 JP26.1
ROUT_JACK
  Bottom 0.152: J12.TIP 42.98,1.22 42.98,8.23 47.55,12.8 47.55,15.24 48.77,16.46 JP6.1
SW_LOAD
  Top 0.152: SW3.3 31.09,103.17 37.49,103.17 SW3.4
  Bottom 0.152: JP25.1 36.73,29.26 36.73,30.18 35.66,31.24 35.66,41.91 43.43,49.68 43.43,57.3 44.81,58.67 44.81,72.54 43.89,73.46 43.89,73.76 40.08,77.57 39.78,77.57 28.5,88.85 28.5,90.37 26.98,91.9 19.2,91.9 19.05,92.05 19.05,93.27 20.88,95.1 23.01,95.1 30.94,103.02 SW3.3
SW_MODE
  Top 0.152: SW2.3 12.5,103.17 18.9,103.17 SW2.4 19.05,103.02 31.24,90.83 40.84,90.83 48.62,83.06 48.62,58.98 47.55,57.91 47.55,31.24 48.77,30.02 JP24.1
SW_REC
  Top 0.152: U$1.1 45.41,73.61 45.41,78.49 U$1.2
  Bottom 0.152: JP29.1 36.88,31.85 36.88,32.61 48.92,44.65 48.92,69.95 45.41,73.46 U$1.1

### Text on the board
bNames: uNimbus_Board_1_v1.2